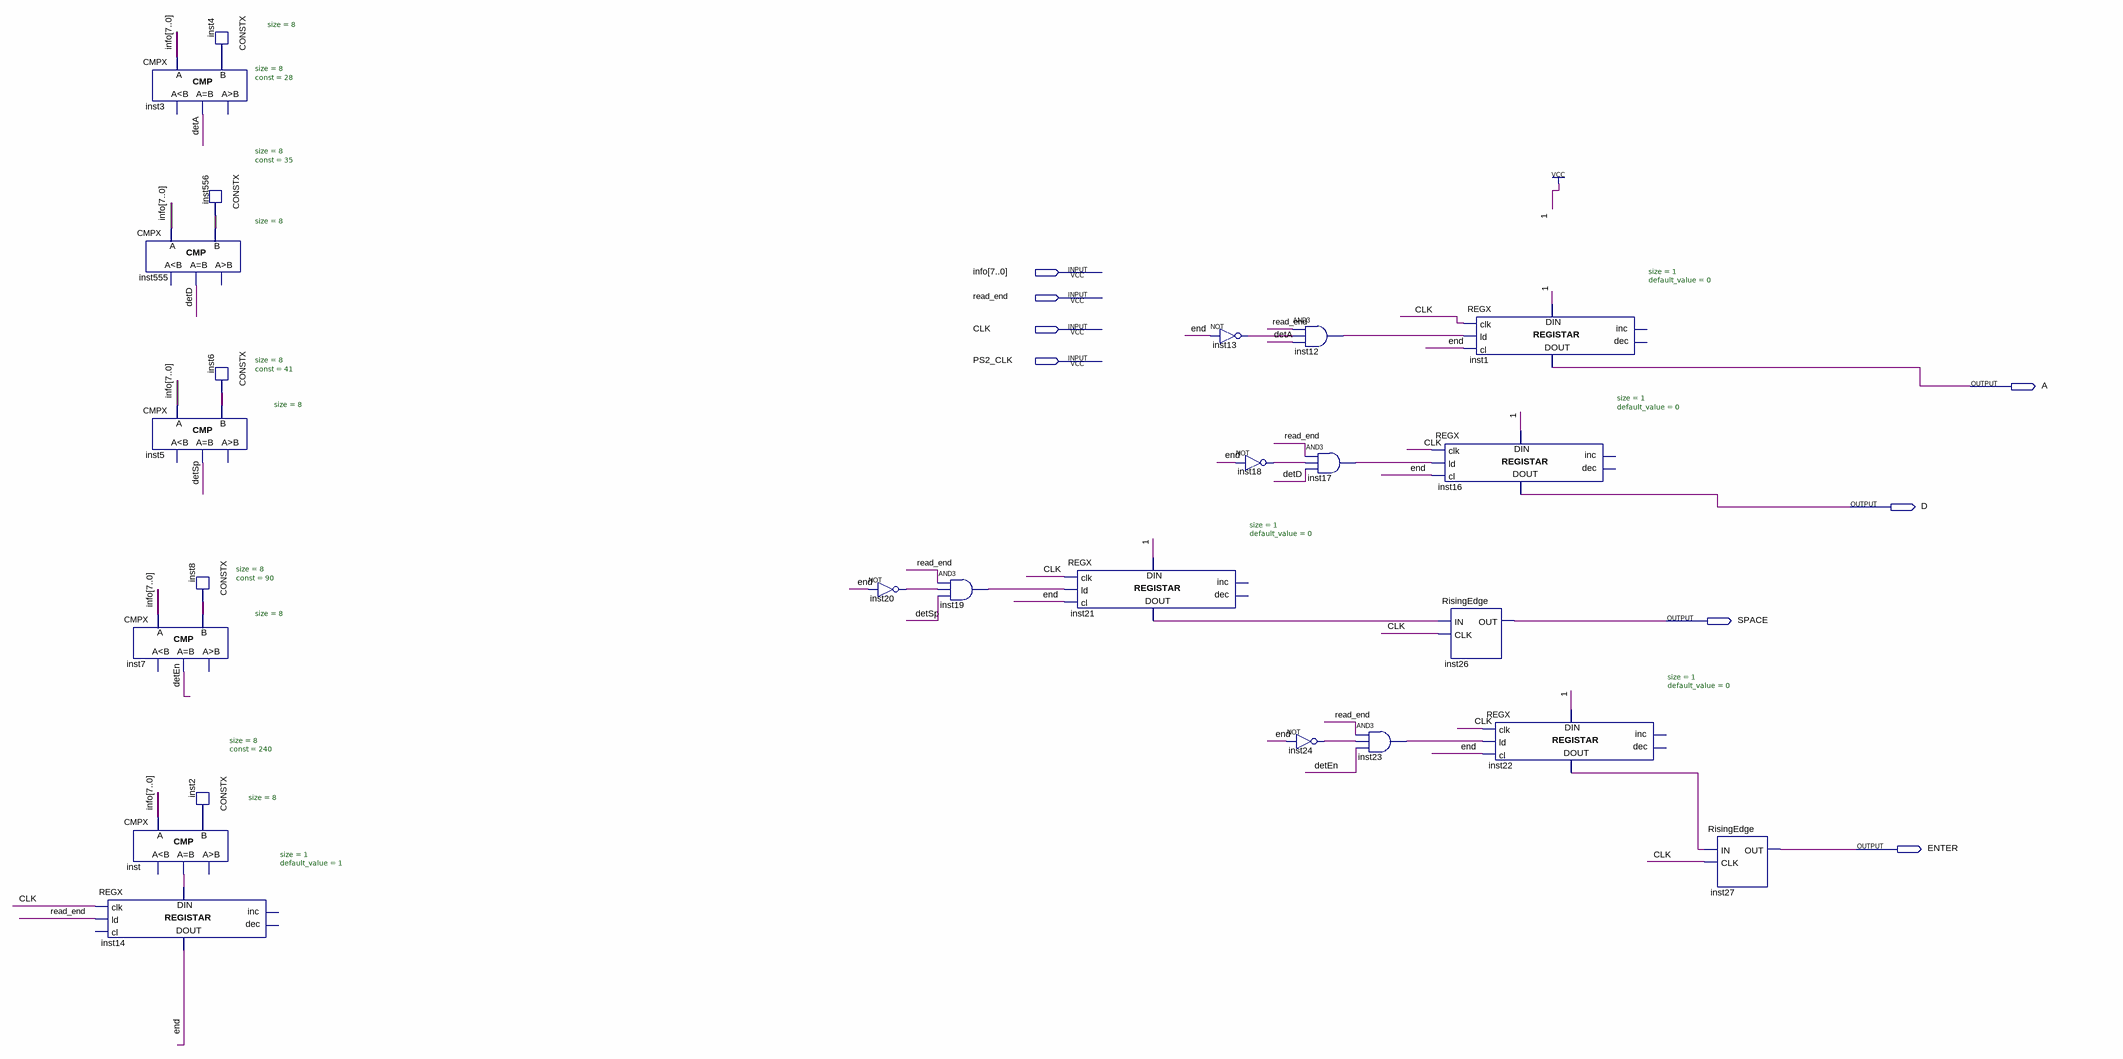
[diagram p0: schematic sheet]
// Quartus schematic Tasteri.bdf as structural Verilog: 25 symbols, 8 pins
module Tasteri (
  input  [7:0] info,
  input  read_end,
  input  CLK,
  input  PS2_CLK,
  output A,
  output D,
  output SPACE,
  output ENTER
);

  wire detA, detD, detEn, detSp, \end , inst12_out, inst13_out, inst17_out, inst18_out, inst19_out,
       inst20_out, inst21_data_out, inst22_data_out, inst23_out, inst24_out, inst_eq;
  wire [7:0] inst2_data, inst4_data, inst6_data, inst8_data, inst556_data;

  CMPX #(.size(8)) inst555 (.A(info), .B(inst556_data), .eq(detD));  // open: ls, gr
  CMPX #(.size(8)) inst7 (.A(info), .B(inst8_data), .eq(detEn));  // open: ls, gr
  CMPX #(.size(8)) inst (.A(info), .B(inst2_data), .eq(inst_eq));  // open: ls, gr
  REGX #(.size(1), .default_value(1)) inst14 (
    .clk(CLK), .ld(read_end), .data_in(inst_eq), .data_out(\end ));  // open: cl, inc, dec
  CMPX #(.size(8)) inst3 (.A(info), .B(inst4_data), .eq(detA));  // open: ls, gr
  CMPX #(.size(8)) inst5 (.A(info), .B(inst6_data), .eq(detSp));  // open: ls, gr
  CONSTX #(.size(8), .\const (90)) inst8 (.data(inst8_data));
  CONSTX #(.size(8), .\const (240)) inst2 (.data(inst2_data));
  CONSTX #(.size(8), .\const (28)) inst4 (.data(inst4_data));
  CONSTX #(.size(8), .\const (35)) inst556 (.data(inst556_data));
  CONSTX #(.size(8), .\const (41)) inst6 (.data(inst6_data));
  not inst20 (inst20_out, \end );
  and inst19 (inst19_out, read_end, inst20_out, detSp);
  REGX #(.size(1), .default_value(0)) inst21 (
    .clk(CLK), .ld(inst19_out), .cl(\end ), .data_in(1'b1), .data_out(inst21_data_out));  // open: inc, dec
  not inst13 (inst13_out, \end );
  not inst18 (inst18_out, \end );
  and inst12 (inst12_out, read_end, inst13_out, detA);
  not inst24 (inst24_out, \end );
  and inst17 (inst17_out, read_end, inst18_out, detD);
  and inst23 (inst23_out, read_end, inst24_out, detEn);
  REGX #(.size(1), .default_value(0)) inst16 (
    .clk(CLK), .ld(inst17_out), .cl(\end ), .data_in(1'b1), .data_out(D));  // open: inc, dec
  RisingEdge inst26 (.IN(inst21_data_out), .CLK(CLK), .OUT(SPACE));
  REGX #(.size(1), .default_value(0)) inst1 (
    .clk(CLK), .ld(inst12_out), .cl(\end ), .data_in(1'b1), .data_out(A));  // open: inc, dec
  REGX #(.size(1), .default_value(0)) inst22 (
    .clk(CLK), .ld(inst23_out), .cl(\end ), .data_in(1'b1), .data_out(inst22_data_out));  // open: inc, dec
  RisingEdge inst27 (.IN(inst22_data_out), .CLK(CLK), .OUT(ENTER));
endmodule
